# Altium schematic sheet fpga.SchDoc: FPGA (Spartan 6)
size A3; Author: GAA; Organization: heig-vd; Address1: heig-vd; Address2: Route de Cheseaux 1; Address3: 1401 Yverdon-les-Bains; Address4: Suisse; DocumentNumber: 4; Revision: 1.1; SheetNumber: 4; SheetTotal: 12
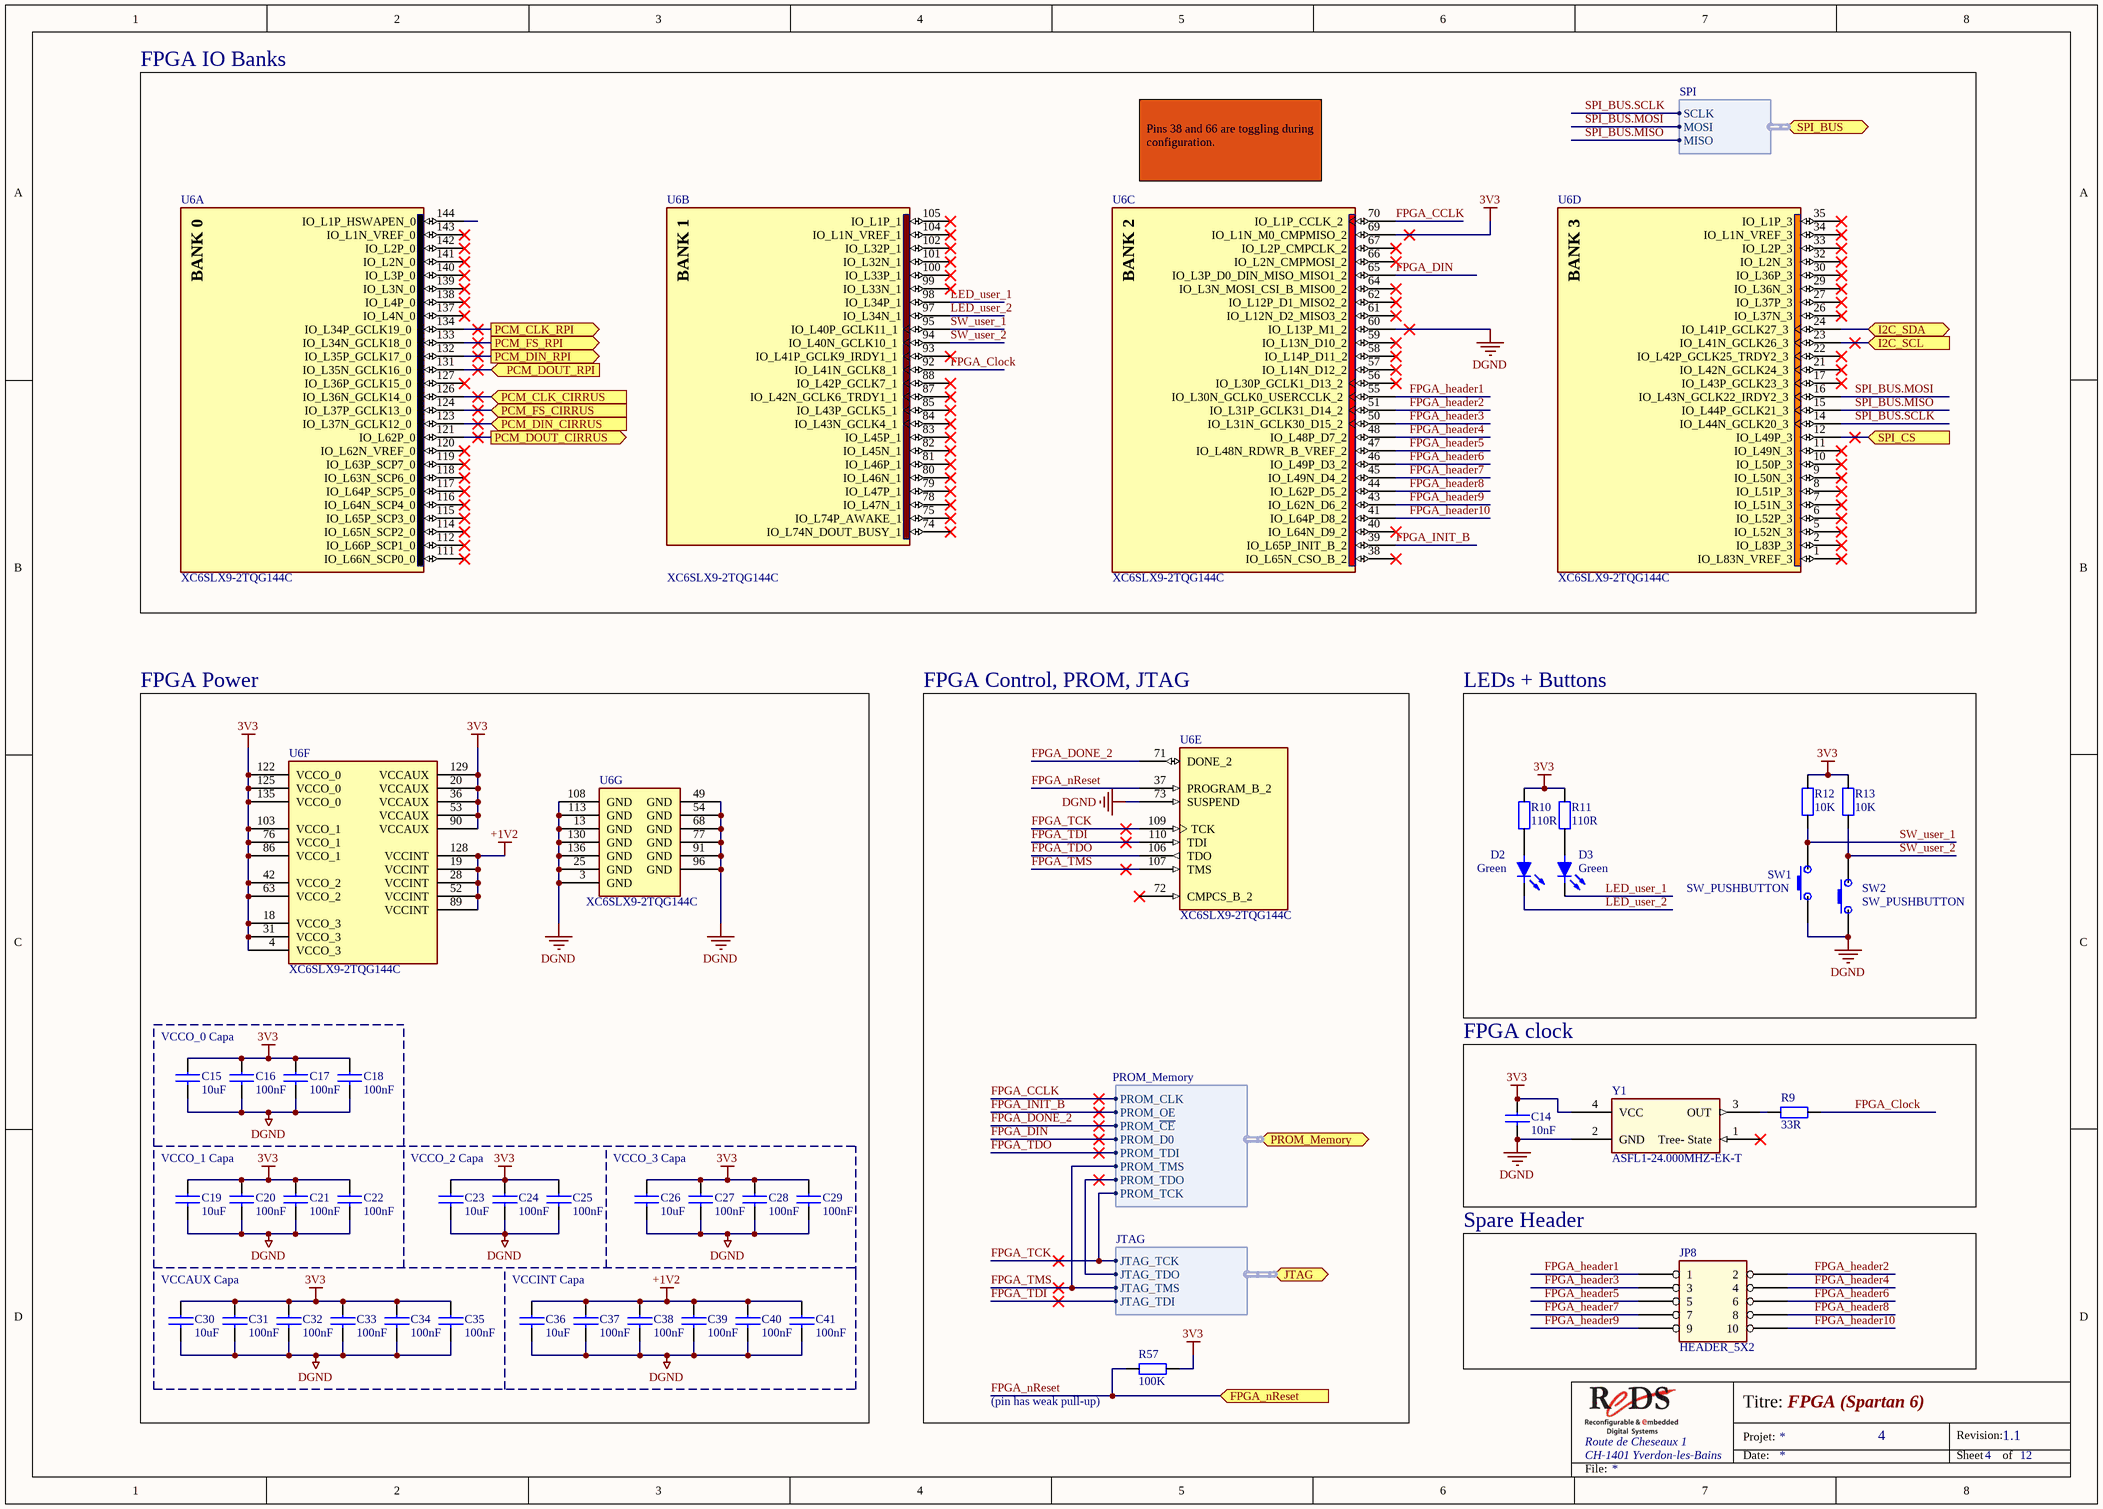
[diagram p0: fpga.SchDoc]

## Parts
C14  10nF  [SM/C_0603]
C15  10uF  [SM/C_1206]
C16  100nF  [SM/C_0603]
C17  100nF  [SM/C_0603]
C18  100nF  [SM/C_0603]
C19  10uF  [SM/C_1206]
C20  100nF  [SM/C_0603]
C21  100nF  [SM/C_0603]
C22  100nF  [SM/C_0603]
C23  10uF  [SM/C_1206]
C24  100nF  [SM/C_0603]
C25  100nF  [SM/C_0603]
C26  10uF  [SM/C_1206]
C27  100nF  [SM/C_0603]
C28  100nF  [SM/C_0603]
C29  100nF  [SM/C_0603]
C30  10uF  [SM/C_1206]
C31  100nF  [SM/C_0603]
C32  100nF  [SM/C_0603]
C33  100nF  [SM/C_0603]
C34  100nF  [SM/C_0603]
C35  100nF  [SM/C_0603]
C36  10uF  [SM/C_1206]
C37  100nF  [SM/C_0603]
C38  100nF  [SM/C_0603]
C39  100nF  [SM/C_0603]
C40  100nF  [SM/C_0603]
C41  100nF  [SM/C_0603]
D2  value Green  [PLCC_2]  (hidden comment: HSMG-A100-J02J1)
D3  value Green  [PLCC_2]  (hidden comment: HSMG-A100-J02J1)
JP8  HEADER_5X2  [BLKCON.100/VH/TM2OE/W.200/10]  (no BOM)
R9  33R  [SM/R_0603]
R10  110R  [SM/R_0603]
R11  110R  [SM/R_0603]
R12  10K  [SM/R_0603]
R13  10K  [SM/R_0603]
R57  100K  [SM/R_0603]
SW1  SW_PUSHBUTTON  [TE Connectivity_SWITCH_SERIES-FSMSM]
SW2  SW_PUSHBUTTON  [TE Connectivity_SWITCH_SERIES-FSMSM]
U6  XC6SLX9-2TQG144C  [TQFP-144]  (parts A,B,C,D,E,F,G of 7)
Y1  Manufacturer P/N: ASFL1-24.000MHZ-EK-T  [ABRACON_OSCILLATOR_ASFL1 SERIES]  (hidden comment: OSCILLATOR_2)

## Blocks framed on the sheet
FPGA IO Banks: U6
FPGA Power: C15-C41 U6
FPGA Control, PROM, JTAG: R57 U6
LEDs + Buttons: D2 D3 R10-R13 SW1 SW2
FPGA clock: C14 R9 Y1
Spare Header: JP8

## Ports
FPGA_nReset (in), I2C_SCL (in), I2C_SDA (bidir), JTAG (harness JTAG), PCM_CLK_CIRRUS (in), PCM_CLK_RPI (out), PCM_DIN_CIRRUS (in), PCM_DIN_RPI (out), PCM_DOUT_CIRRUS (out), PCM_DOUT_RPI (in), PCM_FS_CIRRUS (in), PCM_FS_RPI (out), PROM_Memory (harness PROM_Memory), SPI_BUS (harness SPI), SPI_CS (in)

## Harnesses
JTAG: JTAG_TCK, JTAG_TDI, JTAG_TDO, JTAG_TMS
PROM_Memory: PROM_CLK, PROM_OE, PROM_~{CE}, PROM_D0, PROM_TDI, PROM_TDO, PROM_TCK, PROM_TMS
SPI: SCLK, MOSI, MISO

## Nets
3V3: C14.1 C15.1 C16.1 C17.1 C18.1 C19.1 C20.1 C21.1 C22.1 C23.1 C24.1 C25.1 C26.1 C27.1 C28.1 C29.1 C30.1 C31.1 C32.1 C33.1 C34.1 C35.1 R10.1 R11.1 R12.1 R13.1 R57.2 U6.4(VCCO_3) U6.18(VCCO_3) U6.20(VCCAUX) U6.31(VCCO_3) U6.36(VCCAUX) U6.42(VCCO_2) U6.53(VCCAUX) U6.63(VCCO_2) U6.69(IO_L1N_M0_CMPMISO_2) U6.76(VCCO_1) U6.86(VCCO_1) U6.90(VCCAUX) U6.103(VCCO_1) U6.122(VCCO_0) U6.125(VCCO_0) U6.129(VCCAUX) U6.135(VCCO_0) Y1.4(VCC)
+1V2: C36.1 C37.1 C38.1 C39.1 C40.1 C41.1 U6.19(VCCINT) U6.28(VCCINT) U6.52(VCCINT) U6.89(VCCINT) U6.128(VCCINT)
DGND: C14.2 C15.2 C16.2 C17.2 C18.2 C19.2 C20.2 C21.2 C22.2 C23.2 C24.2 C25.2 C26.2 C27.2 C28.2 C29.2 C30.2 C31.2 C32.2 C33.2 C34.2 C35.2 C36.2 C37.2 C38.2 C39.2 C40.2 C41.2 SW1.1 SW2.1 U6.3(GND) U6.13(GND) U6.25(GND) U6.49(GND) U6.54(GND) U6.60(IO_L13P_M1_2) U6.68(GND) U6.73(SUSPEND) U6.77(GND) U6.91(GND) U6.96(GND) U6.108(GND) U6.113(GND) U6.130(GND) U6.136(GND) Y1.2(GND)
FPGA_CCLK: U6.70(IO_L1P_CCLK_2) ; port PROM_Memory.PROM_CLK
FPGA_Clock: R9.2 U6.92(IO_L41N_GCLK8_1)
FPGA_DIN: U6.65(IO_L3P_D0_DIN_MISO_MISO1_2) ; port PROM_Memory.PROM_D0
FPGA_DONE_2: U6.71(DONE_2) ; port PROM_Memory.PROM_~{CE}
FPGA_header1: JP8.1 U6.55(IO_L30N_GCLK0_USERCCLK_2)
FPGA_header2: JP8.2 U6.51(IO_L31P_GCLK31_D14_2)
FPGA_header3: JP8.3 U6.50(IO_L31N_GCLK30_D15_2)
FPGA_header4: JP8.4 U6.48(IO_L48P_D7_2)
FPGA_header5: JP8.5 U6.47(IO_L48N_RDWR_B_VREF_2)
FPGA_header6: JP8.6 U6.46(IO_L49P_D3_2)
FPGA_header7: JP8.7 U6.45(IO_L49N_D4_2)
FPGA_header8: JP8.8 U6.44(IO_L62P_D5_2)
FPGA_header9: JP8.9 U6.43(IO_L62N_D6_2)
FPGA_header10: JP8.10 U6.41(IO_L64P_D8_2)
FPGA_INIT_B: U6.39(IO_L65P_INIT_B_2) ; port PROM_Memory.PROM_OE
FPGA_nReset: R57.1 U6.37(PROGRAM_B_2) ; port FPGA_nReset
FPGA_TCK: U6.109(TCK) ; port JTAG.JTAG_TCK, port PROM_Memory.PROM_TCK
FPGA_TDI: U6.110(TDI) ; port JTAG.JTAG_TDI
FPGA_TDO: U6.106(TDO) ; port PROM_Memory.PROM_TDI
FPGA_TMS: U6.107(TMS) ; port JTAG.JTAG_TMS, port PROM_Memory.PROM_TMS
I2C_SCL: U6.23(IO_L41N_GCLK26_3) ; port I2C_SCL
I2C_SDA: U6.24(IO_L41P_GCLK27_3) ; port I2C_SDA
LED_user_1: D3.2(C) U6.98(IO_L34P_1)
LED_user_2: D2.2(C) U6.97(IO_L34N_1)
PCM_CLK_CIRRUS: U6.126(IO_L36N_GCLK14_0) ; port PCM_CLK_CIRRUS
PCM_CLK_RPI: U6.134(IO_L34P_GCLK19_0) ; port PCM_CLK_RPI
PCM_DIN_CIRRUS: U6.123(IO_L37N_GCLK12_0) ; port PCM_DIN_CIRRUS
PCM_DIN_RPI: U6.132(IO_L35P_GCLK17_0) ; port PCM_DIN_RPI
PCM_DOUT_CIRRUS: U6.121(IO_L62P_0) ; port PCM_DOUT_CIRRUS
PCM_DOUT_RPI: U6.131(IO_L35N_GCLK16_0) ; port PCM_DOUT_RPI
PCM_FS_CIRRUS: U6.124(IO_L37P_GCLK13_0) ; port PCM_FS_CIRRUS
PCM_FS_RPI: U6.133(IO_L34N_GCLK18_0) ; port PCM_FS_RPI
SPI_BUS.MISO: U6.15(IO_L44P_GCLK21_3) ; port SPI_BUS.MISO
SPI_BUS.MOSI: U6.16(IO_L43N_GCLK22_IRDY2_3) ; port SPI_BUS.MOSI
SPI_BUS.SCLK: U6.14(IO_L44N_GCLK20_3) ; port SPI_BUS.SCLK
SPI_CS: U6.12(IO_L49P_3) ; port SPI_CS
SW_user_1: R12.2 SW1.2 U6.95(IO_L40P_GCLK11_1)
SW_user_2: R13.2 SW2.2 U6.94(IO_L40N_GCLK10_1)
NetD2_1: D2.1(A) R10.2
NetD3_1: D3.1(A) R11.2
NetR9_1: R9.1 Y1.3(OUT)
(unnamed): port JTAG.JTAG_TDO, port PROM_Memory.PROM_TDO

Not connected (* = marked no-connect by the designer): U6 1(IO_L83N_VREF_3)* 2(IO_L83P_3)* 5(IO_L52N_3)* 6(IO_L52P_3)* 7(IO_L51N_3)* 8(IO_L51P_3)* 9(IO_L50N_3)* 10(IO_L50P_3)* 11(IO_L49N_3)* 17(IO_L43P_GCLK23_3)* 21(IO_L42N_GCLK24_3)* 22(IO_L42P_GCLK25_TRDY2_3)* 26(IO_L37N_3)* 27(IO_L37P_3)* 29(IO_L36N_3)* 30(IO_L36P_3)* 32(IO_L2N_3)* 33(IO_L2P_3)* 34(IO_L1N_VREF_3)* 35(IO_L1P_3)* 38(IO_L65N_CSO_B_2)* 40(IO_L64N_D9_2)* 56(IO_L30P_GCLK1_D13_2)* 57(IO_L14N_D12_2)* 58(IO_L14P_D11_2)* 59(IO_L13N_D10_2)* 61(IO_L12N_D2_MISO3_2)* 62(IO_L12P_D1_MISO2_2)* 64(IO_L3N_MOSI_CSI_B_MISO0_2)* 66(IO_L2N_CMPMOSI_2)* 67(IO_L2P_CMPCLK_2)* 72(CMPCS_B_2)* 74(IO_L74N_DOUT_BUSY_1)* 75(IO_L74P_AWAKE_1)* 78(IO_L47N_1)* 79(IO_L47P_1)* 80(IO_L46N_1)* 81(IO_L46P_1)* 82(IO_L45N_1)* 83(IO_L45P_1)* 84(IO_L43N_GCLK4_1)* 85(IO_L43P_GCLK5_1)* 87(IO_L42N_GCLK6_TRDY1_1)* 88(IO_L42P_GCLK7_1)* 93(IO_L41P_GCLK9_IRDY1_1)* 99(IO_L33N_1)* 100(IO_L33P_1)* 101(IO_L32N_1)* 102(IO_L32P_1)* 104(IO_L1N_VREF_1)* 105(IO_L1P_1)* 111(IO_L66N_SCP0_0)* 112(IO_L66P_SCP1_0)* 114(IO_L65N_SCP2_0)* 115(IO_L65P_SCP3_0)* 116(IO_L64N_SCP4_0)* 117(IO_L64P_SCP5_0)* 118(IO_L63N_SCP6_0)* 119(IO_L63P_SCP7_0)* 120(IO_L62N_VREF_0)* 127(IO_L36P_GCLK15_0)* 137(IO_L4N_0)* 138(IO_L4P_0)* 139(IO_L3N_0)* 140(IO_L3P_0)* 141(IO_L2N_0)* 142(IO_L2P_0)* 143(IO_L1N_VREF_0)* 144(IO_L1P_HSWAPEN_0); Y1 1(Tree-_State)*

## Notes on the sheet
- (near U6) Pins 38 and 66 are toggling during configuration.
- VCCO_0 Capa
- VCCO_1 Capa
- VCCO_2 Capa
- VCCO_3 Capa
- VCCAUX Capa
- VCCINT Capa
- (near R57) (pin has weak pull-up)
- Route de Cheseaux 1
- CH-1401 Yverdon-les-Bains
- Titre:
- Date:
- Projet:
- Revision:
- Sheet
- of
- File:
- (in symbol 2185, part A) BANK 0
- (in symbol 2185, part B) BANK 1
- (in symbol 2185, part C) BANK 2
- (in symbol 2185, part D) BANK 3

## Library data of the parts
C14 = 195: Capacitor, ceramic; Manufacturer: Kemet; Manufacturer P/N: C0603C103J5RAC-TU; ID: 195; Voltage: 50V; Tolerance: ±5%; Value: 10nF; Component Type: Capacitor, non-polarized; Supplier 1: Farnell; Supplier Part Number 1: 1650831; RoHS Compliant: True
C15 C19 C23 C26 C30 C36 = 1985: Chip Monolithic Ceramic Capacitor; Manufacturer: muRata; Manufacturer P/N: GRM31CR6YA106KA12L; ID: 1985; Voltage: 35V; Tolerance: ±10%; Value: 10uF; Component Type: Capacitor, non-polarized; Supplier 1: Farnell; Supplier Part Number 1: 1797011; Supplier 2: Digi-Key; Supplier Part Number 2: 490-5524-2-ND; RoHS Compliant: True
C16-C18 C20-C22 C24 C25 C27-C29 C31-C35 C37-C41 = 182: Ceramic multi-layer; Manufacturer: AVX; Manufacturer P/N: 0603YC104KAZ2A; ID: 182; Voltage: 16V; Tolerance: ±10%; Value: 100nF; Component Type: Capacitor, non-polarized; Supplier 1: Farnell; Supplier Part Number 1: 7569556; RoHS Compliant: True
D2 D3 = 2254: SMT LED Green, Single Color PLCC-2 Type; Manufacturer: Broadcom/Avago; ID: 2254; Voltage: 2,2V; Component Type: Led; Manufacturer P/N: HSMG-A100-J02J1; Supplier 1: Mouser; Supplier Part Number 1: 630-HSMG-A100-J02J1; RoHS Compliant: True
JP8 = 74: Barrette double 2x5 poles 2.54mm; Manufacturer: TE Connectivity; Manufacturer P/N: 5-826632-0; ID: 74; Connector Type: Barrette 2.54mm; Component Type: Barrette 2.54mm; Supplier 1: Distrelec; Supplier Part Number 1: 122363; ComponentLink1Description: Datasheet; ComponentLink1URL: #https://www.distrelec.ch/ishop/Datasheets/eh826629_draw.pdf#; ComponentLink2Description: Supplier; ComponentLink2URL: https://www.distrelec.ch/barrette-%C3%A0-broches-50-p%C3%B4les-1p-x50/te-connectivity/5-826629-0/122354/fr; RoHS Compliant1: False
R9 = 73: Résistance 0603 63mW 1% 33R; Manufacturer: Multicomp; Manufacturer P/N: MC 0.036mW 0603 1% 33R; ID: 73; Voltage: 50V; Value: 33R; Component Type: Résistance; Power: 63mW; Tolerance: 1%; Supplier 1: Farnell; Supplier Part Number 1: 9331050; RoHS Compliant: False
R10 R11 = 86: Résistance 0603 63mW 1% 110R; Manufacturer: Multicomp; Manufacturer P/N: MC 0.036mW 0603 1% 110R; ID: 86; Voltage: 50V; Value: 110R; Component Type: Résistance; Power: 63mW; Tolerance: 1%; Supplier 1: Farnell; Supplier Part Number 1: 9330437; RoHS Compliant: False
R12 R13 = 133: Résistance 0603 63mW 1% 10K; Manufacturer: Multicomp; Manufacturer P/N: MC 0.036mW 0603 1% 10K; ID: 133; Voltage: 50V; Value: 10K; Component Type: Résistance; Power: 63mW; Tolerance: 1%; Supplier 1: Farnell; Supplier Part Number 1: 9330399; RoHS Compliant: False
R57 = 157: Résistance 0603 63mW 1% 100K; Manufacturer: Multicomp; Manufacturer P/N: MC 0.036mW 0603 1% 100K; ID: 157; Voltage: 50V; Value: 100K; Component Type: Résistance; Power: 63mW; Tolerance: 1%; Supplier 1: Farnell; Supplier Part Number 1: 9330402; RoHS Compliant: False
SW1 SW2 = 2027: SWITCH TACTILE SPST-NO 0.05A 12V; Manufacturer: TE Connectivity; Manufacturer P/N: FSMSM; ID: 2027; Component Type: SWITCH; Value: SPST-NO; Voltage: 12V; Supplier 1: Farnell; Supplier Part Number 1: 1703878; Supplier 2: Digi-Key; Supplier Part Number 2: 450-1758-1-ND; RoHS Compliant: True; ComponentLink1Description: Datasheet; ComponentLink2Description: Supplier
U6 = 2185: XC2C256 Spartan-6 LX 1.2V FPGA, 102 User I/Os, 144-Pin TQFP (0.5mm Pitch), Speed Grade 2, Commercial Grade, Pb-FreeCoolRunner-II CPLD 256-BGA; Manufacturer: Xilinx; ID: 2185; Body: 20x20mm; Component Type: IC; Manufacturer P/N: XC6SLX9-2TQG144C; Category: uP, uControleurs, Interface; Package Type: TQFP-144; Pitch: 0.5mm; Value: XC6SLX9-2TQG144C; Supplier 1: Digi-Key; Supplier Part Number 1: 122-1745-ND; RoHS Compliant: True; ComponentLink1Description: Datasheet; ComponentLink1URL: http://www.xilinx.com/support/documentation/data_sheets/ds094.pdf#; ComponentLink2Description: Supplier; ComponentLink2URL: http://www.digikey.fr/scripts/dksearch/dksus.dll?vendor=0&keywords=122-1400-ND
Y1 = 2297: Oscillateur SMD 5mmx3.2mmx0.85mm; Manufacturer: ABRACON Corporation; ID: 2297; Value: 24MHz; Voltage: 3.3V; Component Type: OSCILLATEUR; Supplier 1: Digi-Key; Supplier Part Number 1: 300-8252-1-ND; Supplier 2: Mouser; Supplier Part Number 2: 815-ASFL1-24.0-EC-T; RoHS Compliant: True; ComponentLink1Description: Datasheet; ComponentLink1URL: http://www.abracon.com/Oscillators/ASFL1.pdf; ComponentLink2Description: Supplier; ComponentLink2URL: http://www.mouser.ch/ProductDetail/ABRACON/ASFL1-24000MHZ-EC-T/?qs=%2fha2pyFaduhkDQ%2fq4itgUyHZwRZJIINyimA6uuxc3PZITTZsM6hurYP2p4lXrK0m